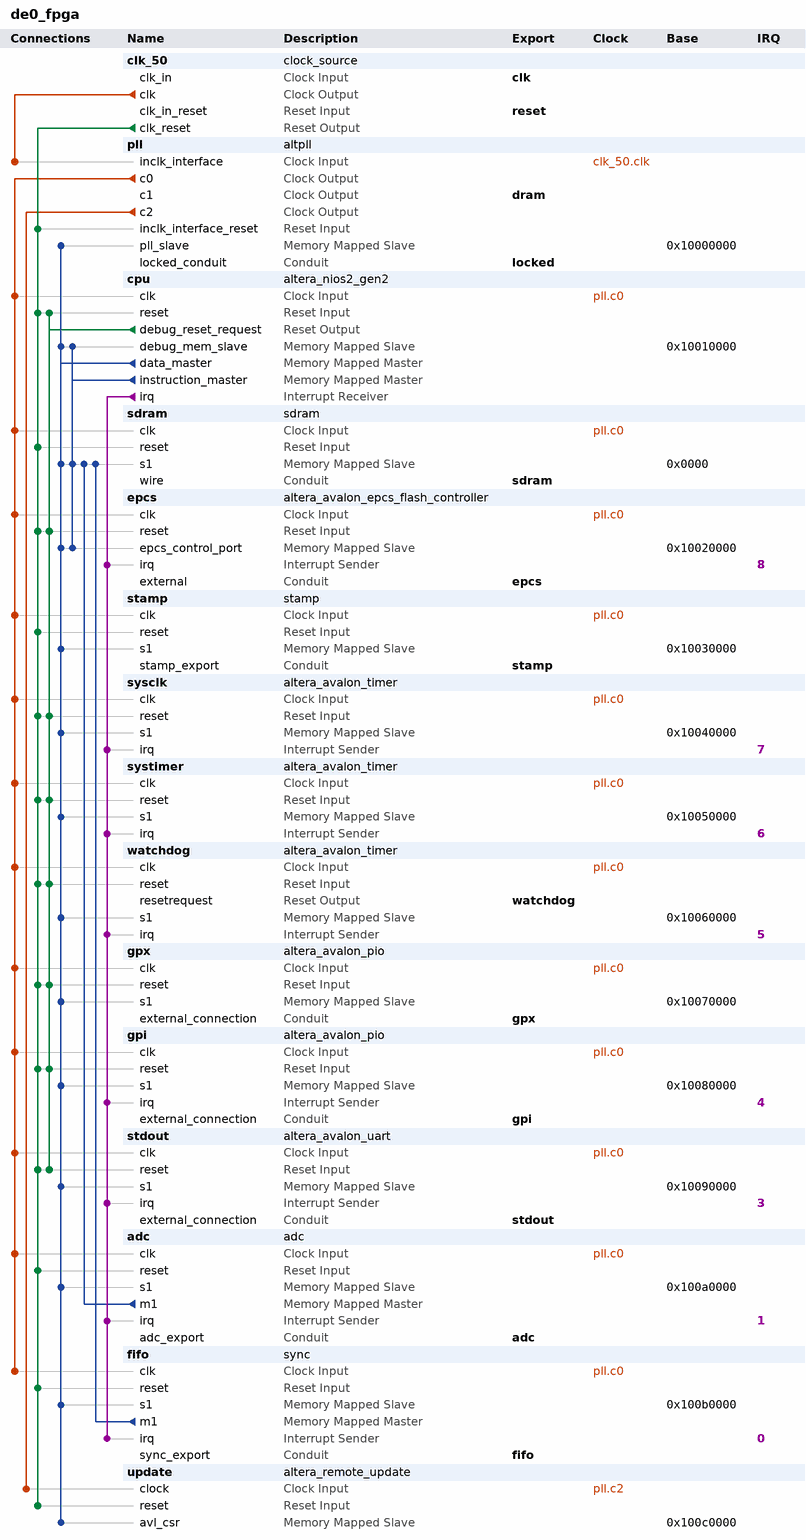
[diagram p0: system contents]
# Platform Designer (Qsys) system de0_fpga, Cyclone IV E EP4CE22F17C6
# Parameters at their usual value, and those the tool derives, are not listed.
package require -exact qsys 22.1
create_system de0_fpga
set_project_property DEVICE_FAMILY {Cyclone IV E}
set_project_property DEVICE EP4CE22F17C6

add_instance clk_50 clock_source 22.1
set_instance_parameter_value clk_50 clockFrequency 50000000

add_instance pll altpll 22.1
set_instance_parameter_value pll CLK0_DIVIDE_BY 1
set_instance_parameter_value pll CLK0_MULTIPLY_BY 2
set_instance_parameter_value pll CLK1_DIVIDE_BY 1
set_instance_parameter_value pll CLK1_DUTY_CYCLE 50
set_instance_parameter_value pll CLK1_MULTIPLY_BY 2
set_instance_parameter_value pll CLK1_PHASE_SHIFT -1667
set_instance_parameter_value pll CLK2_DIVIDE_BY 5
set_instance_parameter_value pll CLK2_DUTY_CYCLE 50
set_instance_parameter_value pll CLK2_MULTIPLY_BY 4
set_instance_parameter_value pll CLK2_PHASE_SHIFT 0
set_instance_parameter_value pll INCLK0_INPUT_FREQUENCY 20000
set_instance_parameter_value pll PORT_ARESET PORT_UNUSED
set_instance_parameter_value pll PORT_LOCKED PORT_USED
set_instance_parameter_value pll PORT_clk1 PORT_USED
set_instance_parameter_value pll PORT_clk2 PORT_USED
set_instance_parameter_value pll PORT_clk3 PORT_UNUSED

add_instance cpu altera_nios2_gen2 22.1
set_instance_parameter_value cpu dcache_size 0
set_instance_parameter_value cpu dividerType srt2
set_instance_parameter_value cpu exceptionSlave sdram.s1
set_instance_parameter_value cpu icache_burstType Sequential
set_instance_parameter_value cpu icache_size 4096
set_instance_parameter_value cpu impl Fast
set_instance_parameter_value cpu mul_shift_choice 1
set_instance_parameter_value cpu resetSlave epcs.epcs_control_port

add_instance sdram sdram 22.1

add_instance epcs altera_avalon_epcs_flash_controller 22.1
set_instance_parameter_value epcs resetrequest_enabled true

add_instance stamp stamp 22.1

add_instance sysclk altera_avalon_timer 22.1
set_instance_parameter_value sysclk alwaysRun true
set_instance_parameter_value sysclk fixedPeriod true
set_instance_parameter_value sysclk period 10
set_instance_parameter_value sysclk periodUnits MSEC

add_instance systimer altera_avalon_timer 22.1
set_instance_parameter_value systimer alwaysRun true
set_instance_parameter_value systimer fixedPeriod true
set_instance_parameter_value systimer period 4294967295
set_instance_parameter_value systimer periodUnits CLOCKS

add_instance watchdog altera_avalon_timer 22.1
set_instance_parameter_value watchdog alwaysRun true
set_instance_parameter_value watchdog fixedPeriod true
set_instance_parameter_value watchdog period 2
set_instance_parameter_value watchdog periodUnits SEC
set_instance_parameter_value watchdog resetOutput true
set_instance_parameter_value watchdog snapshot false

add_instance gpx altera_avalon_pio 22.1
set_instance_parameter_value gpx direction Bidir
set_instance_parameter_value gpx simDoTestBenchWiring true
set_instance_parameter_value gpx width 7

add_instance gpi altera_avalon_pio 22.1
set_instance_parameter_value gpi bitClearingEdgeCapReg true
set_instance_parameter_value gpi direction Input
set_instance_parameter_value gpi edgeType FALLING
set_instance_parameter_value gpi generateIRQ true
set_instance_parameter_value gpi simDoTestBenchWiring true
set_instance_parameter_value gpi width 7

add_instance stdout altera_avalon_uart 22.1
set_instance_parameter_value stdout baud 115200
set_instance_parameter_value stdout dataBits 8
set_instance_parameter_value stdout fixedBaud true
set_instance_parameter_value stdout parity NONE
set_instance_parameter_value stdout stopBits 1

add_instance adc adc 22.1

add_instance fifo sync 22.1

add_instance update altera_remote_update 22.1
set_instance_parameter_value update CBX_AUTO_BLACKBOX ALL
set_instance_parameter_value update DEVICE EP4CE22F17C6
set_instance_parameter_value update GUI_config_device EPCQ256
set_instance_parameter_value update check_app_pof false
set_instance_parameter_value update check_avalon_interface true
set_instance_parameter_value update m_support_write_config_check true
set_instance_parameter_value update operation_mode REMOTE

# connections
add_connection clk_50.clk pll.inclk_interface clock
add_connection pll.c0 adc.clk clock
add_connection pll.c0 cpu.clk clock
add_connection pll.c0 epcs.clk clock
add_connection pll.c0 fifo.clk clock
add_connection pll.c0 gpi.clk clock
add_connection pll.c0 gpx.clk clock
add_connection pll.c0 sdram.clk clock
add_connection pll.c0 stamp.clk clock
add_connection pll.c0 stdout.clk clock
add_connection pll.c0 sysclk.clk clock
add_connection pll.c0 systimer.clk clock
add_connection pll.c0 watchdog.clk clock
add_connection pll.c2 update.clock clock
add_connection clk_50.clk_reset adc.reset reset
add_connection clk_50.clk_reset cpu.reset reset
add_connection clk_50.clk_reset epcs.reset reset
add_connection clk_50.clk_reset fifo.reset reset
add_connection clk_50.clk_reset gpi.reset reset
add_connection clk_50.clk_reset gpx.reset reset
add_connection clk_50.clk_reset pll.inclk_interface_reset reset
add_connection clk_50.clk_reset sdram.reset reset
add_connection clk_50.clk_reset stamp.reset reset
add_connection clk_50.clk_reset stdout.reset reset
add_connection clk_50.clk_reset sysclk.reset reset
add_connection clk_50.clk_reset systimer.reset reset
add_connection clk_50.clk_reset update.reset reset
add_connection clk_50.clk_reset watchdog.reset reset
add_connection cpu.debug_reset_request cpu.reset reset
add_connection cpu.debug_reset_request epcs.reset reset
add_connection cpu.debug_reset_request gpi.reset reset
add_connection cpu.debug_reset_request gpx.reset reset
add_connection cpu.debug_reset_request stdout.reset reset
add_connection cpu.debug_reset_request sysclk.reset reset
add_connection cpu.debug_reset_request systimer.reset reset
add_connection cpu.debug_reset_request watchdog.reset reset
add_connection adc.m1 sdram.s1 avalon
set_connection_parameter_value adc.m1/sdram.s1 baseAddress 0x0000
add_connection cpu.data_master adc.s1 avalon
set_connection_parameter_value cpu.data_master/adc.s1 baseAddress 0x100a0000
add_connection cpu.data_master cpu.debug_mem_slave avalon
set_connection_parameter_value cpu.data_master/cpu.debug_mem_slave baseAddress 0x10010000
add_connection cpu.data_master epcs.epcs_control_port avalon
set_connection_parameter_value cpu.data_master/epcs.epcs_control_port baseAddress 0x10020000
add_connection cpu.data_master fifo.s1 avalon
set_connection_parameter_value cpu.data_master/fifo.s1 baseAddress 0x100b0000
add_connection cpu.data_master gpi.s1 avalon
set_connection_parameter_value cpu.data_master/gpi.s1 baseAddress 0x10080000
add_connection cpu.data_master gpx.s1 avalon
set_connection_parameter_value cpu.data_master/gpx.s1 baseAddress 0x10070000
add_connection cpu.data_master pll.pll_slave avalon
set_connection_parameter_value cpu.data_master/pll.pll_slave baseAddress 0x10000000
add_connection cpu.data_master sdram.s1 avalon
set_connection_parameter_value cpu.data_master/sdram.s1 baseAddress 0x0000
add_connection cpu.data_master stamp.s1 avalon
set_connection_parameter_value cpu.data_master/stamp.s1 baseAddress 0x10030000
add_connection cpu.data_master stdout.s1 avalon
set_connection_parameter_value cpu.data_master/stdout.s1 baseAddress 0x10090000
add_connection cpu.data_master sysclk.s1 avalon
set_connection_parameter_value cpu.data_master/sysclk.s1 baseAddress 0x10040000
add_connection cpu.data_master systimer.s1 avalon
set_connection_parameter_value cpu.data_master/systimer.s1 baseAddress 0x10050000
add_connection cpu.data_master update.avl_csr avalon
set_connection_parameter_value cpu.data_master/update.avl_csr baseAddress 0x100c0000
add_connection cpu.data_master watchdog.s1 avalon
set_connection_parameter_value cpu.data_master/watchdog.s1 baseAddress 0x10060000
add_connection cpu.instruction_master cpu.debug_mem_slave avalon
set_connection_parameter_value cpu.instruction_master/cpu.debug_mem_slave baseAddress 0x10010000
add_connection cpu.instruction_master epcs.epcs_control_port avalon
set_connection_parameter_value cpu.instruction_master/epcs.epcs_control_port baseAddress 0x10020000
add_connection cpu.instruction_master sdram.s1 avalon
set_connection_parameter_value cpu.instruction_master/sdram.s1 baseAddress 0x0000
add_connection fifo.m1 sdram.s1 avalon
set_connection_parameter_value fifo.m1/sdram.s1 baseAddress 0x0000
add_connection cpu.irq adc.irq interrupt
set_connection_parameter_value cpu.irq/adc.irq irqNumber 1
add_connection cpu.irq epcs.irq interrupt
set_connection_parameter_value cpu.irq/epcs.irq irqNumber 8
add_connection cpu.irq fifo.irq interrupt
set_connection_parameter_value cpu.irq/fifo.irq irqNumber 0
add_connection cpu.irq gpi.irq interrupt
set_connection_parameter_value cpu.irq/gpi.irq irqNumber 4
add_connection cpu.irq stdout.irq interrupt
set_connection_parameter_value cpu.irq/stdout.irq irqNumber 3
add_connection cpu.irq sysclk.irq interrupt
set_connection_parameter_value cpu.irq/sysclk.irq irqNumber 7
add_connection cpu.irq systimer.irq interrupt
set_connection_parameter_value cpu.irq/systimer.irq irqNumber 6
add_connection cpu.irq watchdog.irq interrupt
set_connection_parameter_value cpu.irq/watchdog.irq irqNumber 5

# exported interfaces
add_interface adc conduit end
set_interface_property adc EXPORT_OF adc.adc_export
add_interface clk clock sink
set_interface_property clk EXPORT_OF clk_50.clk_in
add_interface dram clock source
set_interface_property dram EXPORT_OF pll.c1
add_interface epcs conduit end
set_interface_property epcs EXPORT_OF epcs.external
add_interface fifo conduit end
set_interface_property fifo EXPORT_OF fifo.sync_export
add_interface gpi conduit end
set_interface_property gpi EXPORT_OF gpi.external_connection
add_interface gpx conduit end
set_interface_property gpx EXPORT_OF gpx.external_connection
add_interface locked conduit end
set_interface_property locked EXPORT_OF pll.locked_conduit
add_interface reset reset sink
set_interface_property reset EXPORT_OF clk_50.clk_in_reset
add_interface sdram conduit end
set_interface_property sdram EXPORT_OF sdram.wire
add_interface stamp conduit end
set_interface_property stamp EXPORT_OF stamp.stamp_export
add_interface stdout conduit end
set_interface_property stdout EXPORT_OF stdout.external_connection
add_interface watchdog reset source
set_interface_property watchdog EXPORT_OF watchdog.resetrequest

set_interconnect_requirement {$system} qsys_mm.clockCrossingAdapter HANDSHAKE
set_interconnect_requirement {$system} qsys_mm.enableEccProtection FALSE
set_interconnect_requirement {$system} qsys_mm.insertDefaultSlave FALSE
set_interconnect_requirement {$system} qsys_mm.maxAdditionalLatency 1

save_system de0_fpga.qsys
